# EasyEDA Pro project RP2350-MLX90393(4).epro

# Schematic Schematic3_5
Board Name: rp2350-mlx90393(4); Create Date: 2025-10-01; Page Name: P1; Project Name: RSCM; Schematic Name: Schematic3_5; Update Date: 2025-10-04; Company: 嘉立创EDA; Page Size: A4; Version: V1.0
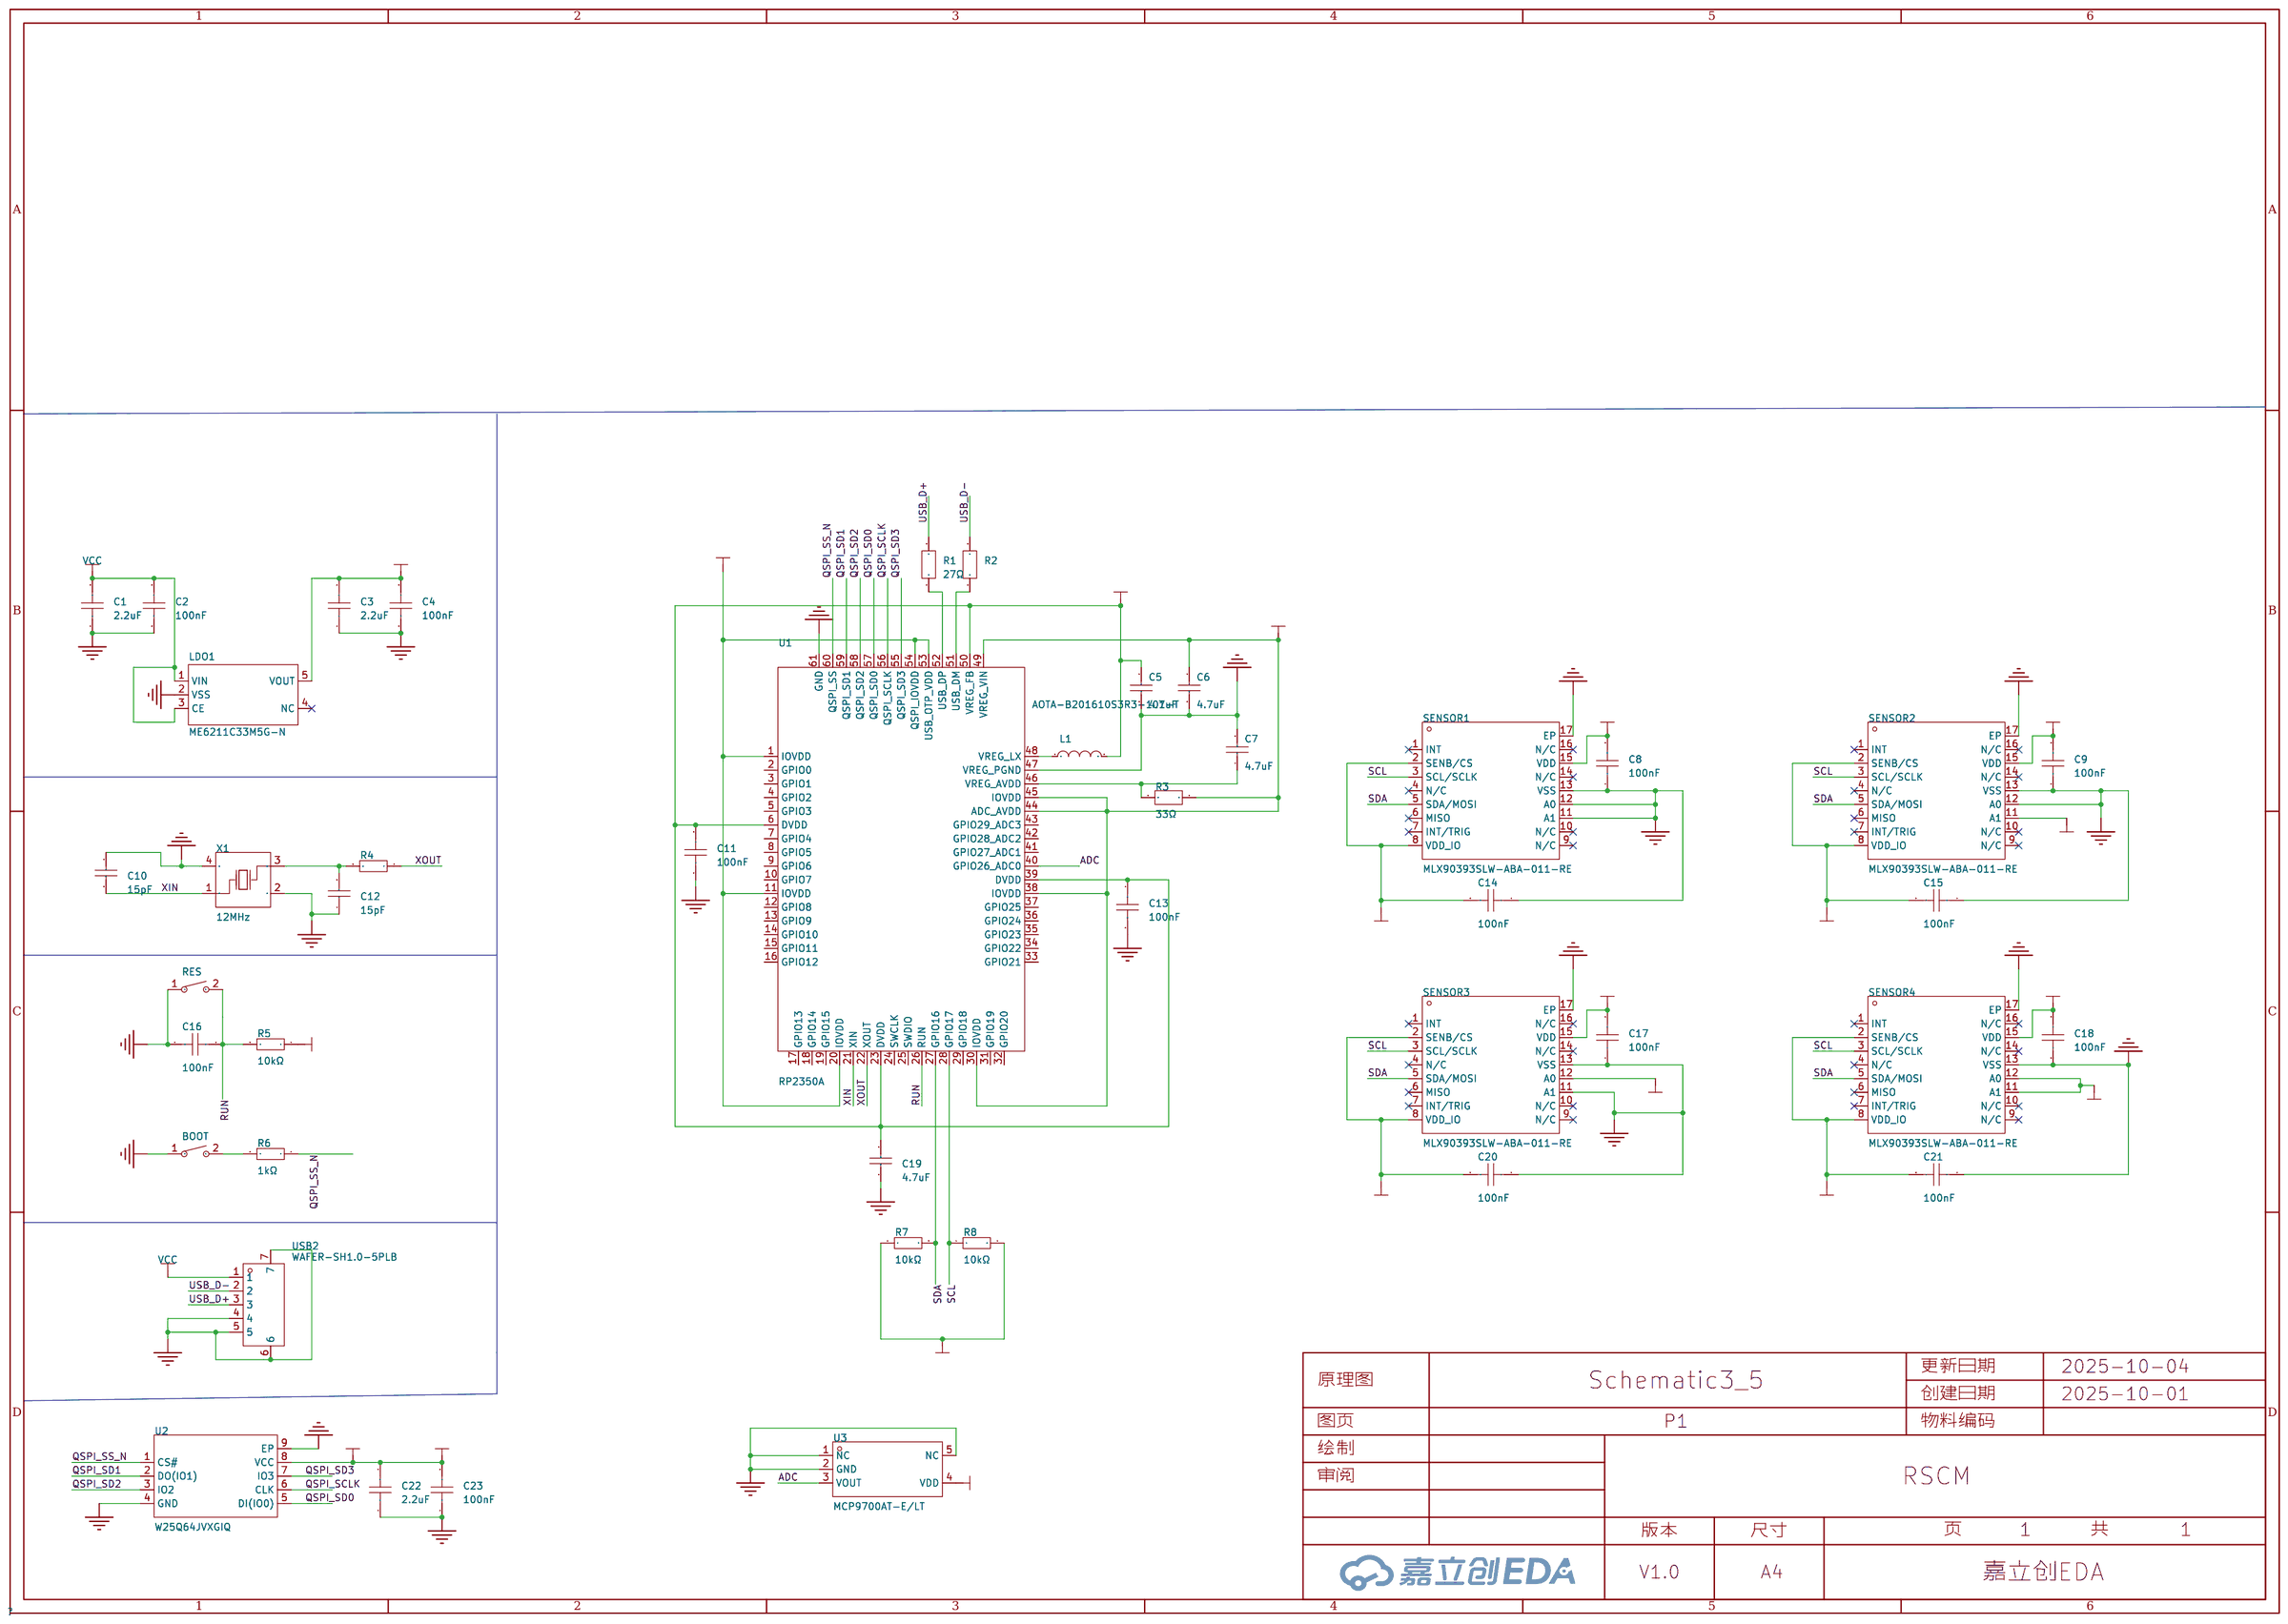
[diagram p0: schematic sheet]

## Parts
BOOT  TS-1071AD-A1B3-D4  [SW-SMD_L4.0-W3.0-LS4.8]
C1  2.2uF  [C0603]
C2  100nF  [C0603]
C3  2.2uF  [C0603]
C4  100nF  [C0603]
C5  4.7uF  [C0603]
C6  4.7uF  [C0603]
C7  4.7uF  [C0603]
C8  100nF  [C0603]
C9  100nF  [C0603]
C10  15pF  [C0603]
C11  100nF  [C0603]
C12  15pF  [C0603]
C13  100nF  [C0603]
C14  100nF  [C0603]
C15  100nF  [C0603]
C16  100nF  [C0603]
C17  100nF  [C0603]
C18  100nF  [C0603]
C19  4.7uF  [C0603]
C20  100nF  [C0603]
C21  100nF  [C0603]
C22  2.2uF  [C0603]
C23  100nF  [C0603]
L1  AOTA-B201610S3R3-101-T  [IND-SMD_L2.0-W1.6_AOTA-B201610S3R3-101-T]
LDO1  ME6211C33M5G-N  [SOT-23-5_L3.0-W1.7-P0.95-LS2.8-BL]
R1  27Ω  [R0603]
R2  27Ω  [R0603]
R3  33Ω  [R0603]
R4  1kΩ  [R0603]
R5  10kΩ  [R0603]
R6  1kΩ  [R0603]
R7  10kΩ  [R0603]
R8  10kΩ  [R0603]
RES  TS-1071AD-A1B3-D4  [SW-SMD_L4.0-W3.0-LS4.8]
SENSOR1  MLX90393SLW-ABA-011-RE  [VQFN-16_L3.0-W3.0-P0.50-BL-EP1.7]
SENSOR2  MLX90393SLW-ABA-011-RE  [VQFN-16_L3.0-W3.0-P0.50-BL-EP1.7]
SENSOR3  MLX90393SLW-ABA-011-RE  [VQFN-16_L3.0-W3.0-P0.50-BL-EP1.7]
SENSOR4  MLX90393SLW-ABA-011-RE  [VQFN-16_L3.0-W3.0-P0.50-BL-EP1.7]
U1  RP2350A  [QFN-60_L7.0-W7.0-P0.40-TL-EP3.4]
U2  W25Q64JVXGIQ  [XSON-8_L4.0-W4.0-P0.80-TL-EP]
U3  MCP9700AT-E/LT  [SC-70-5_L2.1-W1.3-P0.65-LS2.1-TL]
USB2  WAFER-SH1.0-5PLB  [CONN-SMD-5P-P1.00_BM05B-SRSS-TB-LF-SN]
X1  12MHz  [OSC-SMD_4P-L3.2-W2.5-BL]

## Library data of the parts
BOOT RES = TS-1071AD-A1B3-D4: 电路结构:单刀单掷;安装方式:-;按钮形状:圆形按钮;带灯:-;作用力:250gf@±30gf;开关长度:4mm;开关宽度:3mm;开关高度:2mm;; LCSC Part Name: 轻触开关4.0*3.0*2两脚贴片无柱小龟250gf; Supplier Part: C492878; Manufacturer: Yuandi(元迪); JLCPCB Part Class: Extended Part; Datasheet: https://atta.szlcsc.com/upload/public/pdf/source/20200316/C492878_F665FC46291D1CEBBF5F4DDB4422506A.pdf; Supplier: LCSC; Circuit: 单刀单掷; Actuator Style: 圆形按钮; Operating Force: 250gf@±30gf; Switch Length: 4mm; Switch Width: 3mm; Switch Height: 2mm
C1 C3 C22 = CL10A225KB8NNNC: 容值:2.2uF;精度:±10%;额定电压:50V;材质(温度系数):X5R;; LCSC Part Name: 2.2uF ±10% 50V; Supplier Part: C913904; Manufacturer: SAMSUNG(三星); Supplier Footprint: 0603; JLCPCB Part Class: Extended Part; Datasheet: https://atta.szlcsc.com/upload/public/pdf/source/20160218/1457707763339.pdf; Supplier: LCSC; Tolerance: ±10%; Voltage Rated: 50V; Temperature Coefficient: X5R
C2 C4 C8 C9 C11 C13-C18 C20 C21 C23 = CGA0603X7R104K500JT: 容值:100nF;精度:±10%;额定电压:50V;材质(温度系数):X7R;; LCSC Part Name: 100nF ±10% 50V; Supplier Part: C6119867; Manufacturer: HRE(芯声); Supplier Footprint: 0603; JLCPCB Part Class: 扩展库; Supplier: LCSC; Tolerance: ±10%; Voltage Rated: 50V; Temperature Coefficient: X7R
C5-C7 C19 = 0603F475M160NT: 温度系数:Y5V;精度:±20%;容值:4.7uF;额定电压:16V;; LCSC Part Name: 4.7uF(475) ±20% 16V; Supplier Part: C94039; Manufacturer: FH(风华); Supplier Footprint: 0603; JLCPCB Part Class: Extended Part; Datasheet: https://atta.szlcsc.com/upload/public/pdf/source/20171212/C94039_15130640218931178027.pdf; Supplier: LCSC; Temperature Coefficient: Y5V; Tolerance: ±20%; Voltage Rated: 16V
C10 C12 = CC0603JRNPO9BN150: 容值:15pF;精度:±5%;额定电压:50V;材质(温度系数):NP0;; LCSC Part Name: 15pF ±5% 50V; Supplier Part: C107037; Manufacturer: YAGEO(国巨); Supplier Footprint: 0603; JLCPCB Part Class: 扩展库; Datasheet: https://atta.szlcsc.com/upload/public/pdf/source/20170914/C128857_1505359892143968080.pdf; Supplier: LCSC; Tolerance: ±5%; Voltage Rated: 50V; Temperature Coefficient: NP0
L1 = AOTA-B201610S3R3-101-T: Supplier Part: C42411119; Manufacturer: ABRACON; Supplier Footprint: 0806; JLCPCB Part Class: 扩展库; Datasheet: https://item.szlcsc.com/datasheet/AOTA-B201610S3R3-101-T/44392932.html; Supplier: LCSC
LDO1 = ME6211C33M5G-N: 输出类型:固定;工作电压:6V;输出电压:3.3V;输出电流:500mA;电源纹波抑制比(PSRR):70dB@(1kHz)；62dB@(10kHz);输出极性:正极;; LCSC Part Name: 输入6V 输出3.3V 500mA; Supplier Part: C82942; Manufacturer: MICRONE(南京微盟); Supplier Footprint: SOT-23-5; JLCPCB Part Class: 扩展库; Datasheet: https://atta.szlcsc.com/upload/public/pdf/source/20170918/C82942_1505727073070976520.pdf; Supplier: LCSC; Output Type: 固定; Voltage - Supply: 6V; Output Voltage: 3.3V; Output Current: 500mA; Power Supply Rejection Ratio (PSRR): 70dB@(1kHz)；62dB@(10kHz); Voltage Dropout: 260mV@(200mA); Features: 短路保护(SCP)；低ESR；过流保护(OCP)；带使能; Output Configuration: 正极; Number of Outputs: 1
R1 R2 = FRC0603F27R0TS: 电阻类型:厚膜电阻;阻值:27Ω;精度:±1%;功率:100mW;工作电压:75V;温度系数:±100ppm/℃;; LCSC Part Name: 27Ω ±1% 100mW 厚膜电阻; Supplier Part: C2907021; Manufacturer: FOJAN(富捷); Supplier Footprint: 0603; JLCPCB Part Class: Extended Part; Datasheet: https://atta.szlcsc.com/upload/public/pdf/source/20211221/925EC7D7225764EE0046F22065062C87.pdf; Supplier: LCSC; Type: 厚膜电阻; Tolerance: ±1%; Power(Watts): 100mW; Voltage-Supply(Max): 75V; Temperature Coefficient: ±100ppm/℃; Operating Temperature: -55℃~+155℃
R3 = FRC0603F33R0TS: 电阻类型:厚膜电阻;阻值:33Ω;精度:±1%;功率:100mW;工作电压:75V;温度系数:±100ppm/℃;; LCSC Part Name: 33Ω ±1% 100mW 厚膜电阻; Supplier Part: C2909394; Manufacturer: FOJAN(富捷); Supplier Footprint: 0603; JLCPCB Part Class: 扩展库; Supplier: LCSC; Type: 厚膜电阻; Tolerance: ±1%; Power(Watts): 100mW; Voltage-Supply(Max): 75V; Temperature Coefficient: ±100ppm/℃; Operating Temperature: -55℃~+155℃
R4 = 0603WAF1001T5E: 电阻类型:厚膜电阻;阻值:1kΩ;精度:±1%;功率:100mW;最大工作电压:75V;温度系数:±100ppm/℃;; LCSC Part Name: 1kΩ ±1% 100mW 厚膜电阻; Supplier Part: C21190; Manufacturer: UNI-ROYAL(厚声); Supplier Footprint: 0603; JLCPCB Part Class: 基础库; Datasheet: https://atta.szlcsc.com/upload/public/pdf/source/20200306/C422600_1E6D84923E4A46A82E41ADD87F860B5C.pdf; Supplier: LCSC; Type: 厚膜电阻; Tolerance: ±1%; Power(Watts): 100mW; Overload Voltage (Max): 75V; Temperature Coefficient: ±100ppm/℃; Operating Temperature Range: -55℃~+155℃
R5 R6 = RC0603FR-0710KL: 电阻类型:厚膜电阻;阻值:10kΩ;精度:±1%;功率:100mW;; LCSC Part Name: 10kΩ ±1% 100mW; Supplier Part: C98220; Manufacturer: YAGEO(国巨); Supplier Footprint: 0603; JLCPCB Part Class: 扩展库; Datasheet: https://atta.szlcsc.com/upload/public/pdf/source/20170522/1495423494387.pdf; Supplier: LCSC; Type: 厚膜电阻; Tolerance: ±1%; Power(Watts): 100mW; Temperature Coefficient: ±100ppm/℃; Overload Voltage (Max): 75V; Operating Temperature Range: -55℃~+155℃
R7 R8 = 0603WAF4701T5E: 电阻类型:厚膜电阻;阻值:4.7kΩ;精度:±1%;功率:100mW;最大工作电压:75V;温度系数:±100ppm/℃;; LCSC Part Name: 4.7kΩ ±1% 100mW 厚膜电阻; Supplier Part: C23162; Manufacturer: UNI-ROYAL(厚声); Supplier Footprint: 0603; JLCPCB Part Class: Basic Part; Datasheet: https://atta.szlcsc.com/upload/public/pdf/source/20200306/C422600_1E6D84923E4A46A82E41ADD87F860B5C.pdf; Supplier: LCSC; Type: 厚膜电阻; Tolerance: ±1%; Power(Watts): 100mW; Overload Voltage (Max): 75V; Temperature Coefficient: ±100ppm/℃; Operating Temperature Range: -55℃~+155℃
SENSOR1-SENSOR4 = MLX90393SLW-ABA-011-RE: 三轴磁传感器; LCSC Part Name: 三轴磁传感器; Supplier Part: C2649492; Manufacturer: Melexis(比利时迈来芯); Supplier Footprint: QFN-16-EP(3x3); JLCPCB Part Class: 扩展库; Datasheet: https://atta.szlcsc.com/upload/public/pdf/source/20211126/C4B8913B6F87EBCF004CDCA59E4924D2.pdf; Supplier: LCSC
U1 = RP2350A_C42411118: 推荐配套ABRACON  C42411119使用; Supplier Part: C42411118; Manufacturer: Raspberry Pi(树莓派); Supplier Footprint: QFN-60-EP(7x7); JLCPCB Part Class: 扩展库; Datasheet: https://atta.szlcsc.com/upload/public/pdf/source/20241210/0989AB86AAD7A21936E5CD12ADC9EA29.pdf; Supplier: LCSC
U2 = W25Q64JVXGIQ: Supplier Part: C2940195; Manufacturer: WINBOND(华邦); Supplier Footprint: XSON-8-EP(4x4); JLCPCB Part Class: 扩展库; Datasheet: https://atta.szlcsc.com/upload/public/pdf/source/20220111/96C134BA110DAC08742B3CB6C4519B4C.pdf; Supplier: LCSC
U3 = MCP9700AT-E/LT: Supplier Part: C97546; Manufacturer: MICROCHIP(美国微芯); Supplier Footprint: SC-70-5; JLCPCB Part Class: 扩展库; Datasheet: https://atta.szlcsc.com/upload/public/pdf/source/20180329/C97546_891156744EF359E8E03F21D22CC42BFE.pdf; Supplier: LCSC; Supply Voltage: 2.3V~5.5V
USB2 = WAFER-SH1.0-5PLB: 插针结构:1x5P;间距:1mm;安装方式:立贴;参考系列:SH;总PIN数:5P;排数:1;每排PIN数:5;行距:-;额定电流:1A;触头材质:黄铜;触头镀层:-;工作温度:-25℃~+85℃;; LCSC Part Name: 1x5P 间距:1mm 立贴 系列:SH; Supplier Part: C3029335; Manufacturer: XUNPU(讯普); Supplier Footprint: SMD,P=1mm; JLCPCB Part Class: 扩展库; Datasheet: https://atta.szlcsc.com/upload/public/pdf/source/20220527/2BC543D78697EB0EE4D2C73A161B184B.pdf; Supplier: LCSC; Pins Structure: 1x5P; Pitch: 1mm; Mounting Type: 立贴; Reference Series: SH; Number of Pins: 5P; Number of Rows: 1; Number of PINs Per Row: 5; Current Rating: 1A; Contact Material: 黄铜; Operating Temperature: -25℃~+85℃; Voltage Rating: 50V; Plastic Material: LCP; Supplementary Features: 辅助焊脚; Color: 米色; Z-Height of the Board: 4.4mm; X-Length of Bottom Edge on Board (Spacing Line): 7.35mm; Y-Width of Bottom Edge on Board: 3.74mm
X1 = X322512MSB4SI: 晶振类型:贴片晶振;频率:12MHz;常温频差:±10ppm;外接负载电容:20pF;频率稳定度(全温):±20ppm;; LCSC Part Name: 12MHz ±10ppm 20pF; Supplier Part: C9002; Manufacturer: YXC(扬兴晶振); Supplier Footprint: SMD3225-4P; JLCPCB Part Class: 基础库; Datasheet: https://atta.szlcsc.com/upload/public/pdf/source/20240329/19D5F850207469550BEB00D7DFEDBC7A.pdf; Supplier: LCSC; Crystal Type: 贴片晶振; Normal temperature Frequency Tolerance: ±10ppm; External load capacitor: 20pF; Frequency Stability(Full temperature range): ±20ppm; Operating Temperature: -40℃~+85℃

## Nets
+1V1: C5.1 C11.2 C13.1 C19.2 L1.2 U1.6(DVDD) U1.23(DVDD) U1.39(DVDD) U1.50(VREG_FB)
+3V3: C3.2 C4.2 C6.1 C8.2 C9.2 C14.2 C15.2 C17.2 C18.2 C20.2 C21.2 C22.2 C23.2 LDO1.5(VOUT) R3.1 R5.1 R7.1 R8.2 SENSOR1.2(SENB/CS) SENSOR1.8(VDD_IO) SENSOR1.15(VDD) SENSOR2.2(SENB/CS) SENSOR2.8(VDD_IO) SENSOR2.11(A1) SENSOR2.15(VDD) SENSOR3.2(SENB/CS) SENSOR3.8(VDD_IO) SENSOR3.12(A0) SENSOR3.15(VDD) SENSOR4.2(SENB/CS) SENSOR4.8(VDD_IO) SENSOR4.11(A1) SENSOR4.12(A0) SENSOR4.15(VDD) U1.1(IOVDD) U1.11(IOVDD) U1.20(IOVDD) U1.30(IOVDD) U1.38(IOVDD) U1.44(ADC_AVDD) U1.45(IOVDD) U1.49(VREG_VIN) U1.53(USB_OTP_VDD) U1.54(QSPI_IOVDD) U2.8(VCC) U3.4(VDD)
GND: BOOT.1 C1.1 C2.1 C3.1 C4.1 C5.2 C6.2 C7.2 C8.1 C9.1 C10.2 C11.1 C12.1 C13.2 C14.1 C15.1 C16.1 C17.1 C18.1 C19.1 C20.1 C21.1 C22.1 C23.1 LDO1.2(VSS) RES.1 SENSOR1.11(A1) SENSOR1.12(A0) SENSOR1.13(VSS) SENSOR1.17(EP) SENSOR2.12(A0) SENSOR2.13(VSS) SENSOR2.17(EP) SENSOR3.11(A1) SENSOR3.13(VSS) SENSOR3.17(EP) SENSOR4.13(VSS) SENSOR4.17(EP) U1.47(VREG_PGND) U1.61(GND) U2.4(GND) U2.9(EP) U3.1(NC) U3.2(GND) U3.5(NC) USB2.4 USB2.5 USB2.6 USB2.7 X1.2(GND) X1.4(GND)
VCC: C1.2 C2.2 LDO1.1(VIN) LDO1.3(CE) USB2.1
ADC: U1.40(GPIO26_ADC0) U3.3(VOUT)
QSPI_SCLK: U1.56(QSPI_SCLK) U2.6(CLK)
QSPI_SD0: U1.57(QSPI_SD0) U2.5(DI(IO0))
QSPI_SD1: U1.59(QSPI_SD1) U2.2(DO(IO1))
QSPI_SD2: U1.58(QSPI_SD2) U2.3(IO2)
QSPI_SD3: U1.55(QSPI_SD3) U2.7(IO3)
QSPI_SS_N: R6.1 U1.60(QSPI_SS) U2.1(CS#)
RUN: C16.2 R5.2 RES.2 U1.26(RUN)
SCL: R8.1 SENSOR1.3(SCL/SCLK) SENSOR2.3(SCL/SCLK) SENSOR3.3(SCL/SCLK) SENSOR4.3(SCL/SCLK) U1.28(GPIO17)
SDA: R7.2 SENSOR1.5(SDA/MOSI) SENSOR2.5(SDA/MOSI) SENSOR3.5(SDA/MOSI) SENSOR4.5(SDA/MOSI) U1.27(GPIO16)
USB_D+: R1.2 USB2.3
USB_D-: R2.2 USB2.2
XIN: C10.1 U1.21(XIN) X1.1(OSC1)
XOUT: R4.1 U1.22(XOUT)
$1N3876: BOOT.2 R6.2
$1N4061: C12.2 R4.2 X1.3(OSC2)
$1N34618: L1.1 U1.48(VREG_LX)
$1N34796: C7.1 R3.2 U1.46(VREG_AVDD)
$1N38222: R1.1 U1.52(USB_DP)
$1N38227: R2.1 U1.51(USB_DM)

Not connected (* = marked no-connect by the designer): LDO1 4(NC)*; SENSOR1 1(INT)* 4(N/C)* 6(MISO)* 7(INT/TRIG)* 9(N/C)* 10(N/C)* 14(N/C)* 16(N/C)*; SENSOR2 1(INT)* 4(N/C)* 6(MISO)* 7(INT/TRIG)* 9(N/C)* 10(N/C)* 14(N/C)* 16(N/C)*; SENSOR3 1(INT)* 4(N/C)* 6(MISO)* 7(INT/TRIG)* 9(N/C)* 10(N/C)* 14(N/C)* 16(N/C)*; SENSOR4 1(INT)* 4(N/C)* 6(MISO)* 7(INT/TRIG)* 9(N/C)* 10(N/C)* 14(N/C)* 16(N/C)*; U1 2(GPIO0) 3(GPIO1) 4(GPIO2) 5(GPIO3) 7(GPIO4) 8(GPIO5) 9(GPIO6) 10(GPIO7) 12(GPIO8) 13(GPIO9) 14(GPIO10) 15(GPIO11) 16(GPIO12) 17(GPIO13) 18(GPIO14) 19(GPIO15) 24(SWCLK) 25(SWDIO) 29(GPIO18) 31(GPIO19) 32(GPIO20) 33(GPIO21) 34(GPIO22) 35(GPIO23) 36(GPIO24) 37(GPIO25) 41(GPIO27_ADC1) 42(GPIO28_ADC2) 43(GPIO29_ADC3)

# Board PCB16_5
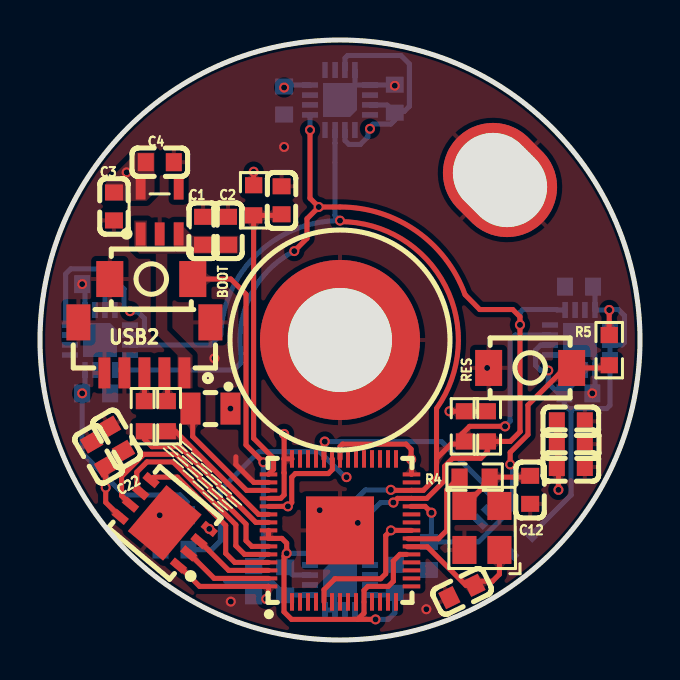
[diagram p1: board, top side]
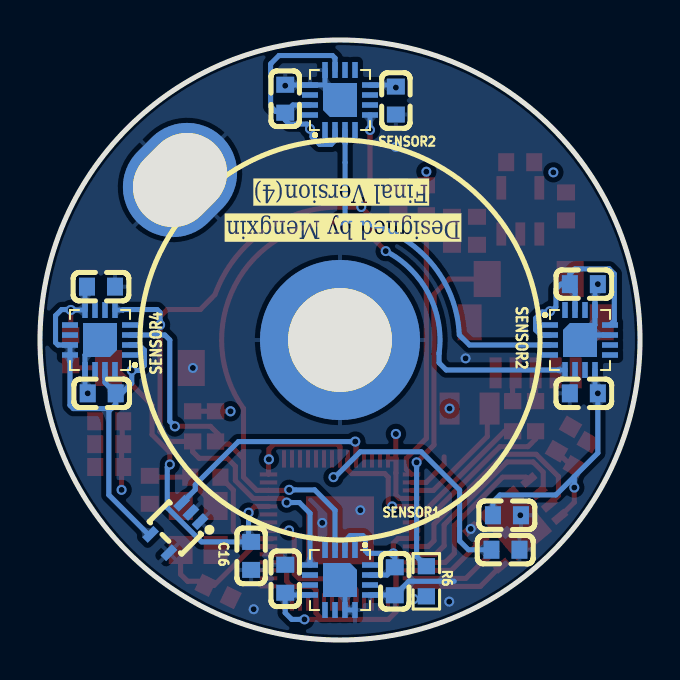
[diagram p2: board, bottom side, seen from below]

Outline 30 x 30 mm; copper layers: Top Layer, GND, POWR, Bottom Layer. Coordinates in mm from the lower left corner of the outline.
Outline path: circle c15,15 r15
Stack: Top Layer 0.035mm 外层铜厚1oz / Dielectric1 0.2104mm 7628 RC49% 8.6mil / GND 0.0152mm 内层铜厚 / Dielectric2 1.065mm 1.1mm H/HOZ 含铜 / POWR 0.0152mm 内层铜厚 / Dielectric3 0.2104mm 7628 RC49% 8.6mil / Bottom Layer 0.035mm 外层铜厚1oz

## Design rules (mm)
template: 自定义配置
spacing copperThickness1oz (default): track to track 0.127, other pairs 0.127 to 0.127
spacing copperThickness2oz: track to track 0.203, other pairs 0.152 to 0.3
track width copperThickness1oz (default): min 0.165, default 0.165, max 2.54
track width copperThickness2oz: min 0.203, default 0.254, max 2.54
differential pair differentialPair (default): width min 0.127, default 0.254, max 2.54; gap min 0.152, default 0.152
differential pair DIFF-100: width min 0.114, default 0.114, max 2.54; gap min 0.1, default 0.152
differential pair DIFF-90: width min 0.147, default 0.147, max 2.54; gap min 0.152, default 0.152
via viaSize (default): diameter min 0.4, default 0.4, max 2.54; hole min 0.3, default 0.3, max 2.54

## Placement (name value [footprint] x y rotation side)
BOOT  TS-1071AD-A1B3-D4  [SW-SMD_L4.0-W3.0-LS4.8]  5.56 18.05 0 top
C1  2.2uF  [C0603]  8.15 20.46 270 top
C2  100nF  [C0603]  9.4 20.46 270 top
C3  2.2uF  [C0603]  3.7 21.68 90 top
C4  100nF  [C0603]  5.99 23.89 180 top
C5  4.7uF  [C0603]  6.73 4.51 180 bottom
C6  4.7uF  [C0603]  6.65 6.24 180 bottom
C7  4.7uF  [C0603]  12.08 21.98 90 top
C8  100nF  [C0603]  12.26 2.94 90 bottom
C9  100nF  [C0603]  17.74 27.06 270 bottom
C10  15pF  [C0603]  21.1 2.43 206 top
C11  100nF  [C0603]  26.54 8.65 180 top
C12  15pF  [C0603]  24.51 7.51 90 top
C13  100nF  [C0603]  26.54 10.94 0 top
C14  100nF  [C0603]  17.74 3.06 270 bottom
C15  100nF  [C0603]  12.21 26.97 90 bottom
C16  100nF  [C0603]  19.44 4.2 90 bottom
C17  100nF  [C0603]  2.81 17.79 0 bottom
C18  100nF  [C0603]  26.95 17.67 0 bottom
C19  4.7uF  [C0603]  26.54 9.79 180 top
C20  100nF  [C0603]  2.81 12.33 180 bottom
C21  100nF  [C0603]  26.91 12.33 180 bottom
C22  2.2uF  [C0603]  2.94 9.28 300 top
C23  100nF  [C0603]  3.82 10.05 300 top
L1  AOTA-B201610S3R3-101-T  [IND-SMD_L2.0-W1.6_AOTA-B201610S3R3-101-T]  8.52 11.57 0 top
LDO1  ME6211C33M5G-N  [SOT-23-5_L3.0-W1.7-P0.95-LS2.8-BL]  5.98 21.45 0 top
NOREF  -  [Pad_e4640]  23 23 315 top
NOREF#2  -  [Pad_e22166]  15 15 0 top
R1  27Ω  [R0603]  5.22 11.19 90 top
R2  27Ω  [R0603]  6.36 11.19 90 top
R3  33Ω  [R0603]  10.68 21.98 270 top
R4  1kΩ  [R0603]  21.73 8.14 0 top
R5  10kΩ  [R0603]  28.46 14.49 270 top
R6  1kΩ  [R0603]  10.68 2.94 90 bottom
R7  10kΩ  [R0603]  22.37 10.68 270 top
R8  10kΩ  [R0603]  21.22 10.68 90 top
RES  TS-1071AD-A1B3-D4  [SW-SMD_L4.0-W3.0-LS4.8]  24.51 13.6 0 top
SENSOR1  MLX90393SLW-ABA-011-RE  [vqfn-16_l3.0-w3.0-p0.50-bl-ep1.7]  15 3 0 bottom
SENSOR2  MLX90393SLW-ABA-011-RE  [VQFN-16_L3.0-W3.0-P0.50-BL-EP1.7]  15 27 180 bottom
SENSOR3  MLX90393SLW-ABA-011-RE  [VQFN-16_L3.0-W3.0-P0.50-BL-EP1.7]  3 15 270 bottom
SENSOR4  MLX90393SLW-ABA-011-RE  [VQFN-16_L3.0-W3.0-P0.50-BL-EP1.7]  27 15 90 bottom
U1  RP2350A  [QFN-60_L7.0-W7.0-P0.40-TL-EP3.4]  15 5.48 90 top
U2  W25Q64JVXGIQ  [XSON-8_L4.0-W4.0-P0.80-TL-EP]  6.24 5.86 140 top
U3  MCP9700AT-E/LT  [SC-70-5_L2.1-W1.3-P0.65-LS2.1-TL]  23.23 5.6 315 bottom
USB2  WAFER-SH1.0-5PLB  [CONN-SMD-5P-P1.00_BM05B-SRSS-TB-LF-SN]  5.22 14.62 180 top
X1  12MHz  [OSC-SMD_4P-L3.2-W2.5-BL]  22.1 5.6 90 top

## Footprints (pads in the part's own frame, mm; a bottom-side part is the same pattern mirrored in y, then rotated)
C0603
  rect 0.8x0.9 smd: 1(-0.7,0) 2(0.7,0)
CONN-SMD-5P-P1.00_BM05B-SRSS-TB-LF-SN
  rect 0.6x1.55 smd: 1(-2,1.262) 2(-1,1.262) 3(0,1.262) 4(1,1.262) 5(2,1.262)
  rect 1.2x1.8 smd: 6(3.3,-1.262) 7(-3.3,-1.262)
IND-SMD_L2.0-W1.6_AOTA-B201610S3R3-101-T
  rect 1x1.6 smd: 1(-1,0) 2(1,0)
OSC-SMD_4P-L3.2-W2.5-BL
  rect 1.4x1.2 smd: 1(-1.1,-0.875) 2(1.1,-0.875) 3(1.1,0.875) 4(-1.1,0.875)
Pad_e4640
  oval 6x5 hole 5x4: 58(0,0)
Pad_e22166
  round 8 hole 5.2: 1(0,0)
QFN-60_L7.0-W7.0-P0.40-TL-EP3.4
  rect 0.875x0.2 smd: 1(-3.575,2.8) 2(-3.575,2.4) 3(-3.575,2) 4(-3.575,1.6) 5(-3.575,1.2) 6(-3.575,0.8) 7(-3.575,0.4) 8(-3.575,0) 9(-3.575,-0.4) 10(-3.575,-0.8) 11(-3.575,-1.2) 12(-3.575,-1.6) 13(-3.575,-2) 14(-3.575,-2.4) 15(-3.575,-2.8) 31(3.575,-2.8) 32(3.575,-2.4) 33(3.575,-2.001) 34(3.575,-1.6) 35(3.575,-1.2) 36(3.575,-0.8) 37(3.575,-0.4) 38(3.575,-0.001) 39(3.575,0.4) 40(3.575,0.8) 41(3.575,1.2) 42(3.575,1.6) 43(3.575,2) 44(3.575,2.4) 45(3.575,2.8)
  rect 0.2x0.875 smd: 16(-2.8,-3.575) 17(-2.4,-3.575) 18(-2,-3.575) 19(-1.6,-3.575) 20(-1.2,-3.575) 21(-0.8,-3.575) 22(-0.4,-3.575) 23(0,-3.575) 24(0.4,-3.575) 25(0.8,-3.575) 26(1.2,-3.575) 27(1.6,-3.575) 28(2,-3.575) 29(2.4,-3.575) 30(2.8,-3.575) 46(2.8,3.575) 47(2.4,3.575) 48(2,3.575) 49(1.6,3.575) 50(1.2,3.575) 51(0.8,3.575) 52(0.4,3.575) 53(0,3.575) 54(-0.4,3.575) 55(-0.8,3.575) 56(-1.2,3.575) 57(-1.6,3.575) 58(-2,3.575) 59(-2.4,3.575) 60(-2.8,3.575)
  rect 3.4x3.4 smd: 61(0,0)
R0603
  rect 0.806x0.864 smd: 1(-0.753,0) 2(0.753,0)
SC-70-5_L2.1-W1.3-P0.65-LS2.1-TL
  rect 0.8x0.4 smd: 1(-1.1,0.65) 2(-1.1,0) 3(-1.1,-0.65) 4(1.1,-0.65) 5(1.1,0.65)
SOT-23-5_L3.0-W1.7-P0.95-LS2.8-BL
  rect 0.49x1.157 smd: 1(-0.95,-1.153) 2(0,-1.153) 3(0.95,-1.153)
  rect 0.49x1.175 smd: 4(0.95,1.153) 5(-0.95,1.153)
SW-SMD_L4.0-W3.0-LS4.8
  rect 1.35x1.8 smd: 1(-2.075,0) 2(2.075,0)
vqfn-16_l3.0-w3.0-p0.50-bl-ep1.7
  rect 0.28x0.8 smd: 1(-0.749,-1.5) 2(-0.249,-1.5) 3(0.249,-1.5) 4(0.75,-1.5) 9(0.75,1.5) 10(0.249,1.5) 11(-0.249,1.5) 12(-0.749,1.5)
  rect 0.8x0.28 smd: 5(1.5,-0.749) 6(1.5,-0.249) 7(1.5,0.249) 8(1.5,0.75) 13(-1.5,0.75) 14(-1.5,0.249) 15(-1.5,-0.249) 16(-1.5,-0.749)
  custom 1.7x1.7 smd: 17(0,0)
VQFN-16_L3.0-W3.0-P0.50-BL-EP1.7
  rect 0.28x0.8 smd: 1(-0.749,-1.5) 2(-0.249,-1.5) 3(0.249,-1.5) 4(0.75,-1.5) 9(0.75,1.5) 10(0.249,1.5) 11(-0.249,1.5) 12(-0.749,1.5)
  rect 0.8x0.28 smd: 5(1.5,-0.749) 6(1.5,-0.249) 7(1.5,0.249) 8(1.5,0.75) 13(-1.5,0.75) 14(-1.5,0.249) 15(-1.5,-0.249) 16(-1.5,-0.749)
  custom 1.7x1.7 smd: 17(0,0)
XSON-8_L4.0-W4.0-P0.80-TL-EP
  rect 0.8x0.4 smd: 1(-1.9,1.2) 2(-1.9,0.4) 3(-1.9,-0.4) 4(-1.9,-1.2) 5(1.9,-1.2) 6(1.9,-0.4) 7(1.9,0.4) 8(1.9,1.2)
  rect 2.3x3 smd: 9(0,0)

## Nets
As in the schematic, except:
GND: BOOT.1 C1.1 C2.1 C3.1 C4.1 C5.2 C6.2 C7.2 C8.1 C9.1 C10.2 C11.1 C12.1 C13.2 C14.1 C15.1 C16.1 C17.1 C18.1 C19.1 C20.1 C21.1 C22.1 C23.1 LDO1.2 NOREF.58 NOREF#2.1 RES.1 SENSOR1.11 SENSOR1.12 SENSOR1.13 SENSOR1.17 SENSOR2.12 SENSOR2.13 SENSOR2.17 SENSOR3.11 SENSOR3.13 SENSOR3.17 SENSOR4.13 SENSOR4.17 U1.47 U1.61 U2.4 U2.9 U3.1 U3.2 U3.5 USB2.4 USB2.5 USB2.6 USB2.7 X1.2 X1.4

Pads without a net: LDO1 4; SENSOR1 1 4 6 7 9 10 14 16; SENSOR2 1 4 6 7 9 10 14 16; SENSOR3 1 4 6 7 9 10 14 16; SENSOR4 1 4 6 7 9 10 14 16; U1 2 3 4 5 7 8 9 10 12 13 14 15 16 17 18 19 24 25 29 31 32 33 34 35 36 37 41 42 43

## Via types
v1: diameter 0.5, hole 0.3, Top Layer to Bottom Layer, 34 vias
v2: diameter 0.508, hole 0.305, Top Layer to Bottom Layer, 10 vias

## Routing (per net, layer and track width the routed paths; a pad name or vN(x,y) marks a point on that pad's centre or on a via; arc(x,y) is an arc through that point)
+1V1: length 53.1
  Top Layer w0.254: C13.1 25.89,10.89 25.89,9.84 C19.2 25.86,9.78 25.92,9.78 v1(25.92,7.51) ; U1.50 v1(12.4,6.68) 12.59,6.87 12.59,8.14 12.77,8.32 14.42,8.32 14.62,8.52 14.62,9.04 U1.39 ; U1.6 14.2,2.52 14.75,3.06 17.03,3.06 17.29,3.32 17.29,5.22 v1(17.55,5.48) U1.23
  POWR w0.254: 16.65,8.02 17.03,7.63 17.03,6.75 17.55,6.23 v1(17.55,5.48) ; 16.65,8.02 16.78,8.14 23.38,8.14 24.4,7.13 25.54,7.13 v1(25.92,7.51) ; 16.65,8.02 16.52,8.14 v1(15.33,8.14) 14.49,8.14 13.35,7 12.71,7 v1(12.4,6.68) 10.22,6.68 9.52,7.38 v1(9.52,11.57)
  Bottom Layer w0.254: C5.1 8.58,4.51 9.02,4.95 9.02,7.5 10.94,9.41 13.98,9.41 15.25,8.14 v1(15.33,8.14)
+3V3: length 179.3
  Top Layer w0.254: C23.2 3.28,8.55 v1(3.28,7.62) 3.28,6.88 U2.8 ; 20.48,11.44 R8.2 R7.1 ; 15.89,1.03 12.58,1.03 12.2,1.41 U1.1 12.2,4.2 v1(12.33,4.33) 12.33,4.84 12.09,5.08 U1.54 U1.53 ; 15.89,1.03 v1(16.78,1.03) ; 15.89,1.03 16.2,1.34 U1.11 16.2,2.48 16.4,2.68 17.41,2.68 17.67,2.94 17.67,3.95 18,4.28 18.33,4.28 ; U1.45 12.2,8.36 12.21,8.36 12.21,7.25 12.03,7.08 U1.49 ; U1.45 12.21,9.06 v2(12.21,10.3) ; U1.45 U1.44 ; U1.38 15,9.67 15.13,9.79 18.3,9.79 18.56,9.54 v2(18.56,9.03) 18.57,9.01 U1.30 ; v1(10.68,23.42) R3.1 ; v2(28.46,16.5) R5.1
  POWR w0.254: 6.17,4.34 arc(4.6,5.86) v1(3.28,7.62) ; 17.15,20.06 arc(20.35,16.26) 19.18,11.43 ; 19.18,11.43 v2(20.48,11.43) 23.37,11.43 v1(25.41,13.48) ; 19.18,11.43 18.56,10.81 v2(18.56,9.03) ; 16.14,23.38 16.52,23.76 16.52,25.54 v1(16.5,25.56) ; 16.14,23.38 16.52,23.38 16.78,23.13 16.78,20.46 17.15,20.06 ; 16.14,23.38 9.28,23.38 ; 4.08,12.33 10.17,12.33 v2(12.21,10.3) ; 4.08,12.33 4.46,12.71 4.46,16.4 v1(4.5,16.44) 4.33,16.61 v1(4.33,23.38) 9.28,23.38 ; 4.08,12.33 v1(2.11,12.33) ; 9.28,23.38 9.92,24.02 9.92,26.68 10.81,27.57 12.16,27.57 v1(12.21,27.62) ; v1(12.33,4.33) 6.17,4.33
  Bottom Layer w0.254: SENSOR4.2 25.04,14.75 24.78,14.49 24.78,13.73 25.03,13.48 v1(25.41,13.48) 25.41,12.84 25.92,12.33 C21.2 ; SENSOR2.2 15.25,24.97 15.44,24.78 16.02,24.78 16.4,25.16 16.4,25.54 16.65,25.8 17.54,25.8 17.74,25.99 C9.2 ; 26.43,11.57 26.56,11.44 26.56,7.25 24.59,5.28 U3.4 ; 26.43,11.57 28.34,11.57 28.5,11.74 SENSOR4.12 SENSOR4.11 29.1,14.75 29.22,14.87 29.22,16.22 28.92,16.52 28.49,16.52 v2(28.46,16.5) SENSOR4.8 27.75,17.57 27.65,17.67 ; 26.43,11.57 26.21,11.79 C21.2 ; SENSOR2.8 12.28,27.75 C15.2 ; v1(3.28,7.62) 3.28,8.17 ; 3.28,8.17 2.11,9.35 v1(2.11,12.33) 2.25,12.48 SENSOR3.8 ; 3.28,8.17 4.21,7.25 7,7.25 7.35,6.9 C6.1 ; C21.2 26.75,12.87 SENSOR4.15 ; SENSOR1.2 14.75,4.96 14.49,5.22 13.86,5.22 13.73,5.09 13.73,4.46 13.6,4.33 v1(12.33,4.33) 12.26,4.26 C8.2 12.65,3.25 SENSOR1.15 ; SENSOR3.12 1.28,15.97 1.28,18.3 1.54,18.56 3.25,18.56 3.51,18.3 C17.2 ; C9.2 17.35,26.75 SENSOR2.15 ; C9.2 17.8,26.43 18.22,26.43 18.47,26.68 18.47,28.8 18.05,29.22 15.38,29.22 15.25,29.09 SENSOR2.11 ; C17.2 3.25,17.53 SENSOR3.15 ; C17.2 3.95,17.79 4.21,17.54 4.21,16.65 4.46,16.4 4.91,16.4 5.22,16.08 5.22,15.5 4.97,15.25 SENSOR3.2 ; SENSOR1.8 17.63,2.25 C14.2 17.74,1.36 17.41,1.03 v1(16.78,1.03)
GND: length 20.3
  Top Layer w0.254: 9.79,9.16 9.79,8.78 10.69,7.88 U1.47
  Bottom Layer w0.254: v1(2.11,17.79) 2.25,17.65 SENSOR3.13 2.25,15.75 2.75,15.25 ; SENSOR3.11 2.75,15.25 ; 2.75,15.25 SENSOR3.17 ; SENSOR1.13 12.28,2.25 C8.1 11.56,2.94 9.28,2.94 ; SENSOR4.17 27.75,14.25 SENSOR4.13 27.75,12.47 v1(27.61,12.33) ; SENSOR2.12 15.75,27.75 ; 15.75,27.75 SENSOR2.13 17.71,27.75 v1(17.74,27.72) ; 15.75,27.75 SENSOR2.17 ; 14.25,1.5 SENSOR1.11 14.75,2.75 SENSOR1.17
  vias: v1(5.98,6.24) v1(8.46,5.55) v1(8.72,14.08) v1(9.54,1.92) v1(12.21,24.65) v1(13.98,6.49) v1(15.89,5.86) v1(19.32,1.54) v1(22.36,13.6)
ADC: length 11
  Top Layer w0.254: v2(14.24,9.92) 14.2,9.88 U1.40
  Bottom Layer w0.254: 22.91,6.84 22.24,7.52 22.24,7.76 20.08,9.92 v2(14.24,9.92)
QSPI_SCLK: length 10.4
  Top Layer w0.254: U1.56 10.22,4.28 9.79,4.71 9.79,5.76 6.65,8.9 5.35,8.9 4.84,8.4 4.84,7.58 U2.6
QSPI_SD0: length 8.5
  Top Layer w0.254: U1.57 9.74,3.88 9.28,4.33 9.28,5.73 6.87,8.14 5.7,8.14 U2.5
QSPI_SD1: length 4.5
  Top Layer w0.254: U2.2 7.46,4.33 8.71,3.08 U1.59
QSPI_SD2: length 4.1
  Top Layer w0.254: 7.95,4.94 7.97,4.94 9.43,3.48 U1.58
QSPI_SD3: length 11.8
  Top Layer w0.254: U1.55 10.59,4.68 10.3,4.97 10.3,5.79 6.81,9.28 5.19,9.28 4.08,8.17 4.08,7.22 4.52,6.77
QSPI_SS_N: length 6.3
  Top Layer w0.254: v1(11.31,2.05) 11.43,2.17 U1.60 7.98,2.68 6.95,3.72 6.92,3.72
  Bottom Layer w0.254: v1(11.31,2.05) 10.81,2.05 R6.1
RUN: length 18
  Top Layer w0.254: v2(19.57,6.36) 19.26,6.68 18.55,6.68 ; v1(23.51,8.78) 23.51,9.38 24.4,10.27 24.4,11.75 26.25,13.6 RES.2 28.33,13.6 R5.2
  Bottom Layer w0.254: v1(23.51,8.78) 23.64,8.65 23.64,6.62 21.92,4.91 C16.2 19.57,5.03 v2(19.57,6.36)
SCL: length 53
  Top Layer w0.254: 15,20.92 arc(20.26,17.72) 19.83,11.57 19.83,9.07 ; 19.83,9.07 20.55,9.79 20.96,9.79 21.1,9.93 21.1,10.3 21.48,10.68 v2(23.25,10.68) ; 19.83,9.07 19.83,8.14 19.17,7.48 18.58,7.48 U1.28 17.57,7.48 v2(17.54,7.51)
  Bottom Layer w0.254: 9.04,15.26 arc(10.87,19.31) v1(15,20.97) 14.75,21.22 14.75,24.84 14.75,24.85 SENSOR2.3 ; 9.03,15.25 8.53,14.75 SENSOR3.3 ; v2(17.54,7.51) 16.27,7.51 15.25,6.49 SENSOR1.3 ; v2(23.25,10.68) 23.51,10.94 23.51,15 23.76,15.25 SENSOR4.3
SDA: length 54.2
  Top Layer w0.254: 15,21.65 arc(18.81,20.45) 21.25,17.27 ; v1(13.5,25.5) 13.5,22.09 v1(13.94,21.65) ; 21.26,17.26 21.99,16.52 23.64,16.52 24,16.16 v2(24,15.76) 24,10.43 ; v1(13.94,21.65) 13.35,21.06 13.35,20.08 v1(12.71,19.44) ; v1(13.94,21.65) 15,21.65 ; 24.02,10.43 23.52,9.93 R7.2 22.37,9.41 22.04,9.08 20.63,9.08 20.23,8.69 20.23,7.97 19.34,7.08 18.58,7.08 U1.27 17.88,7.08 v2(17.67,6.87)
  Bottom Layer w0.254: 10.05,14.3 arc(10.56,17.3) v1(12.71,19.44) ; 10.05,14.36 10.05,13.86 9.69,13.5 SENSOR3.5 ; v2(24,15.76) 24,16.38 24.14,16.52 25.83,16.52 25.86,16.5 SENSOR4.5 ; SENSOR2.5 v1(13.5,25.5) ; SENSOR1.5 16.5,6.34 17.03,6.87 v2(17.67,6.87)
USB_D+: length 1.5
  Top Layer w0.254: USB2.3 5.22,12.07 5.35,11.94
USB_D-: length 1.5
  Top Layer w0.254: USB2.2 6.37,13.2 6.37,11.95
XIN: length 6.8
  Top Layer w0.254: 18.37,4.66 19.37,4.66 21.29,2.73 21.72,2.73 21.93,2.94 22.62,2.94 22.97,3.29 X1.1
XOUT: length 5
  Top Layer w0.254: R4.1 20.33,7.5 20.33,5.47 19.92,5.06 18.4,5.06
$1N3876: length 17.1
  Top Layer w0.254: BOOT.2 9.54,18.05 10.3,17.29 10.3,9.75 v1(11.17,8.88)
  Bottom Layer w0.254: v1(11.17,8.88) 11.17,4.18 R6.2
$1N4061: length 4
  Top Layer w0.254: X1.3 22.48,7.96 R4.2 24.44,8.14 C12.2
$1N34618: length 6.3
  Top Layer w0.254: L1.1 7.63,11.46 7.63,10.17 10.33,7.48 U1.48
$1N34796: length 14.9
  Top Layer w0.254: U1.46 11.68,8.53 11.68,9.09 10.68,10.08 R3.2 12.03,21.23 C7.1
$1N38222: length 8.3
  Top Layer w0.254: U1.52 10.79,5.88 7,9.67 5.6,9.67 5.22,10.05 R1.1
$1N38227: length 6.8
  Top Layer w0.254: U1.51 10.93,6.28 6.77,10.44 R2.1

## Copper pours and planes (outline as drawn; the poured copper is in the pictures)
+3V3 on Top Layer: 3.32,24.37 4.84,24.37 4.84,22.87 3.32,22.87
+3V3 on Top Layer: 3.3,24.37 5.73,24.37 5.73,21.96 3.3,21.96
GND on Top Layer: -1.89,30.88 32.02,30.88 32.02,-1.13 -1.89,-1.13
GND on Bottom Layer: -1.76,31.13 31.64,31.13 31.64,-1.51 -1.76,-1.51
GND on GND: 0.26,29.74 29.74,29.74 29.74,0.26 0.26,0.26
GND on POWR: -1.26,30.88 32.02,30.88 32.02,-1.26 -1.26,-1.26
VCC on Top Layer: 4.71,20.97 6.87,20.97 6.87,19.32 4.71,19.32
VCC on Top Layer: 6.69,20.9 9.92,20.9 9.92,19.32 6.69,19.32
VCC on Top Layer: 5.79,19.32 7.63,19.32 7.63,12.59 5.79,12.59

Small or netless copper shapes (teardrops, artwork), in the pictures only: 85 on Top Layer, 105 on Bottom Layer, 8 on GND, 25 on POWR

## Text on the board
Bottom Silkscreen Layer: SENSOR2 | SENSOR4 | Final Version(4) | Designed by Mengxin
Top Silkscreen Layer: \\\\\ / \\\\\ / \\\\\ / \\\\\ / \\\\\ / \\\\\
